# EAGLE design PGTNX02_2164_vca (EAGLE 9.6.0)
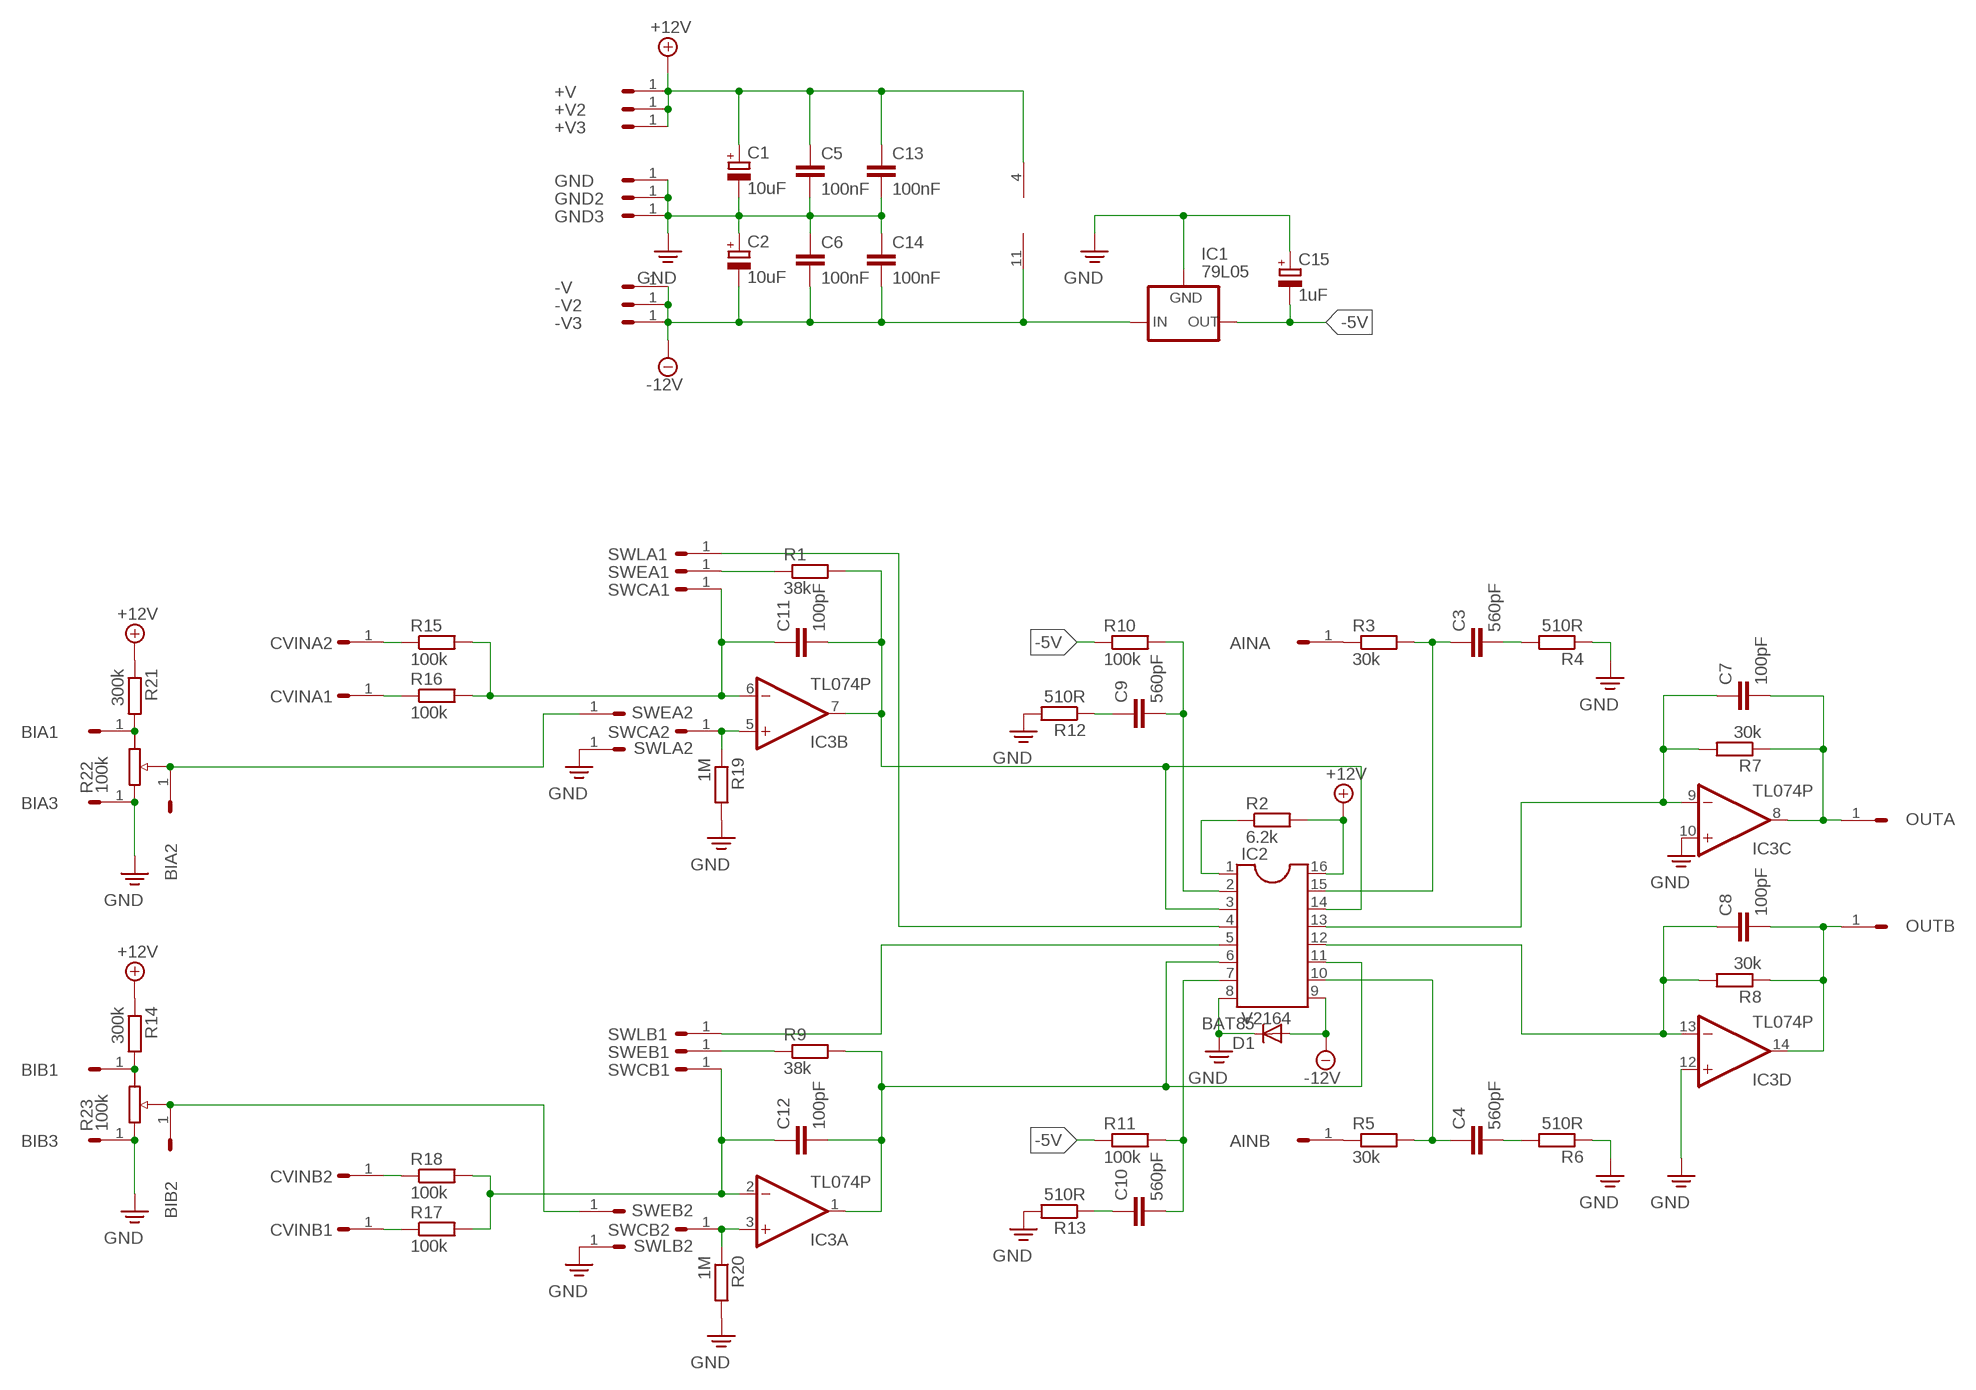
[diagram p0: schematic, sheet 1]

## Parts
+V  HEADER/MALE/01  [HEADER/MALE/01]
+V2  HEADER/MALE/01  [HEADER/MALE/01]
+V3  HEADER/MALE/01  [HEADER/MALE/01]
-V  HEADER/MALE/01  [HEADER/MALE/01]
-V2  HEADER/MALE/01  [HEADER/MALE/01]
-V3  HEADER/MALE/01  [HEADER/MALE/01]
AINA  HEADER/MALE/01  [HEADER/MALE/01]
AINB  HEADER/MALE/01  [HEADER/MALE/01]
BIA1  HEADER/MALE/01  [HEADER/MALE/01]
BIA2  HEADER/MALE/01  [HEADER/MALE/01]
BIA3  HEADER/MALE/01  [HEADER/MALE/01]
BIB1  HEADER/MALE/01  [HEADER/MALE/01]
BIB2  HEADER/MALE/01  [HEADER/MALE/01]
BIB3  HEADER/MALE/01  [HEADER/MALE/01]
C1  10uF  CAPACITOR/POLARIZEDE2.5-6  [E2,5-6]
C2  10uF  CAPACITOR/POLARIZEDE2.5-6  [E2,5-6]
C3  560pF  CAPACITORCERAMICDISC/5  [CERAMICDISC/5]
C4  560pF  CAPACITORCERAMICDISC/5  [CERAMICDISC/5]
C5  100nF  CAPACITORCERAMICDISC/5  [CERAMICDISC/5]
C6  100nF  CAPACITORCERAMICDISC/5  [CERAMICDISC/5]
C7  100pF  CAPACITORCERAMICDISC/5  [CERAMICDISC/5]
C8  100pF  CAPACITORCERAMICDISC/5  [CERAMICDISC/5]
C9  560pF  CAPACITORCERAMICDISC/5  [CERAMICDISC/5]
C10  560pF  CAPACITORCERAMICDISC/5  [CERAMICDISC/5]
C11  100pF  CAPACITORCERAMICDISC/5  [CERAMICDISC/5]
C12  100pF  CAPACITORCERAMICDISC/5  [CERAMICDISC/5]
C13  100nF  CAPACITORCERAMICDISC/5  [CERAMICDISC/5]
C14  100nF  CAPACITORCERAMICDISC/5  [CERAMICDISC/5]
C15  1uF  CAPACITOR/POLARIZEDE2.5-6  [E2,5-6]
CVINA1  HEADER/MALE/01  [HEADER/MALE/01]
CVINA2  HEADER/MALE/01  [HEADER/MALE/01]
CVINB1  HEADER/MALE/01  [HEADER/MALE/01]
CVINB2  HEADER/MALE/01  [HEADER/MALE/01]
D1  BAT85  1N4148DO35-7  [DO35-7]
GND  HEADER/MALE/01  [HEADER/MALE/01]
GND2  HEADER/MALE/01  [HEADER/MALE/01]
GND3  HEADER/MALE/01  [HEADER/MALE/01]
IC1  79L05  79LXX  [79LXX]
IC2  V2164  DIL16  [DIL16]
IC3  TL074P  [DIL14]
OUTA  HEADER/MALE/01  [HEADER/MALE/01]
OUTB  HEADER/MALE/01  [HEADER/MALE/01]
R1  38k  RESISTORRESISTOR/UPRIGHT/7.5  [RESISTOR/7.5]
R2  6.2k  RESISTORRESISTOR/UPRIGHT/7.5  [RESISTOR/7.5]
R3  30k  RESISTORRESISTOR/UPRIGHT/7.5  [RESISTOR/7.5]
R4  510R  RESISTORRESISTOR/UPRIGHT/7.5  [RESISTOR/7.5]
R5  30k  RESISTORRESISTOR/UPRIGHT/7.5  [RESISTOR/7.5]
R6  510R  RESISTORRESISTOR/UPRIGHT/7.5  [RESISTOR/7.5]
R7  30k  RESISTORRESISTOR/UPRIGHT/7.5  [RESISTOR/7.5]
R8  30k  RESISTORRESISTOR/UPRIGHT/7.5  [RESISTOR/7.5]
R9  38k  RESISTORRESISTOR/UPRIGHT/7.5  [RESISTOR/7.5]
R10  100k  RESISTORRESISTOR/UPRIGHT/7.5  [RESISTOR/7.5]
R11  100k  RESISTORRESISTOR/UPRIGHT/7.5  [RESISTOR/7.5]
R12  510R  RESISTORRESISTOR/UPRIGHT/7.5  [RESISTOR/7.5]
R13  510R  RESISTORRESISTOR/UPRIGHT/7.5  [RESISTOR/7.5]
R14  300k  RESISTORRESISTOR/UPRIGHT/7.5  [RESISTOR/7.5]
R15  100k  RESISTORRESISTOR/UPRIGHT/7.5  [RESISTOR/7.5]
R16  100k  RESISTORRESISTOR/UPRIGHT/7.5  [RESISTOR/7.5]
R17  100k  RESISTORRESISTOR/UPRIGHT/7.5  [RESISTOR/7.5]
R18  100k  RESISTORRESISTOR/UPRIGHT/7.5  [RESISTOR/7.5]
R19  1M  RESISTORRESISTOR/UPRIGHT/7.5  [RESISTOR/7.5]
R20  1M  RESISTORRESISTOR/UPRIGHT/7.5  [RESISTOR/7.5]
R21  300k  RESISTORRESISTOR/UPRIGHT/7.5  [RESISTOR/7.5]
R22  100k  POTENTIOMETER  (no package)
R23  100k  POTENTIOMETER  (no package)
SWCA1  HEADER/MALE/01  [HEADER/MALE/01]
SWCA2  HEADER/MALE/01  [HEADER/MALE/01]
SWCB1  HEADER/MALE/01  [HEADER/MALE/01]
SWCB2  HEADER/MALE/01  [HEADER/MALE/01]
SWEA1  HEADER/MALE/01  [HEADER/MALE/01]
SWEA2  HEADER/MALE/01  [HEADER/MALE/01]
SWEB1  HEADER/MALE/01  [HEADER/MALE/01]
SWEB2  HEADER/MALE/01  [HEADER/MALE/01]
SWLA1  HEADER/MALE/01  [HEADER/MALE/01]
SWLA2  HEADER/MALE/01  [HEADER/MALE/01]
SWLB1  HEADER/MALE/01  [HEADER/MALE/01]
SWLB2  HEADER/MALE/01  [HEADER/MALE/01]

## Nets
+12V: +V2.1 +V3.1 +V.1 C1.+ C5.1 C13.1 IC2.16 IC3.4(P:V+) R2.2 R14.1 R21.1
-5V: C15.- IC1.OUT R10.1 R11.1
-12V: -V2.1 -V3.1 -V.1 C2.- C6.2 C14.2 D1.A IC1.IN IC2.9 IC3.11(P:V-)
N$1: C9.2 IC2.2 R10.2
N$2: IC2.1 R2.1
N$3: AINA.1 R3.1
N$4: C3.1 IC2.15 R3.2
N$5: C3.2 R4.2
N$6: C7.1 IC2.13 IC3.9(C:-IN) R7.2
N$7: AINB.1 R5.1
N$8: C4.1 IC2.10 R5.2
N$9: C4.2 R6.2
N$10: C8.1 IC2.12 IC3.13(D:-IN) R8.2
N$11: C10.2 IC2.7 R11.2
N$12: C9.1 R12.1
N$13: C8.2 IC3.14(D:OUT) OUTB.1 R8.1
N$14: C7.2 IC3.8(C:OUT) OUTA.1 R7.1
N$15: R1.1 SWEA1.1
N$16: C11.1 IC3.6(B:-IN) R15.2 R16.2 SWCA1.1
N$17: C10.1 R13.1
N$18: C12.2 IC2.6 IC2.11 IC3.1(A:OUT) R9.2
N$19: IC2.4 SWLA1.1
N$20: C11.2 IC2.3 IC2.14 IC3.7(B:OUT) R1.2
N$21: BIB2.1 R23.S SWEB2.1
N$22: CVINA2.1 R15.1
N$23: CVINA1.1 R16.1
N$24: CVINB1.1 R17.1
N$25: CVINB2.1 R18.1
N$26: C12.1 IC3.2(A:-IN) R17.2 R18.2 SWCB1.1
N$27: R9.1 SWEB1.1
N$28: IC2.5 SWLB1.1
N$29: IC3.5(B:+IN) R19.1 SWCA2.1
N$30: IC3.3(A:+IN) R20.1 SWCB2.1
N$31: BIA1.1 R21.2 R22.A
N$33: BIB1.1 R14.2 R23.A
N$34: BIA2.1 R22.S SWEA2.1
PE: BIA3.1 BIB3.1 C1.- C2.+ C5.2 C6.1 C13.2 C14.1 C15.+ D1.C GND2.1 GND3.1 GND.1 IC1.GND IC2.8 IC3.10(C:+IN) IC3.12(D:+IN) R4.1 R6.1 R12.2 R13.2 R19.2 R20.2 R22.E R23.E SWLA2.1 SWLB2.1 ; supply symbol labelled GND

## Library data of the parts
+V +V2 +V3 -V -V2 -V3 GND GND2 GND3 = connectors:HEADER/MALE/01; SPICEPREFIX: X
AINA AINB BIA1-BIA3 BIB1-BIB3 CVINA1 CVINA2 CVINB1 CVINB2 OUTA OUTB SWCA1 SWCA2 SWCB1 SWCB2 SWEA1 SWEA2 SWEB1 SWEB2 SWLA1 SWLA2 SWLB1 SWLB2 = connectors:HEADER/MALE/01
C1 C2 C15 = capacitors:CAPACITOR/POLARIZED: POLARIZED CAPACITOR, European symbol; SPICEPREFIX: C
C3-C14 = capacitors:CAPACITOR: CAPACITOR, European symbol
D1 = transistors:1N4148: DIODE high speed (Philips)
IC1 = v-reg:79LXX: VOLTAGE REGULATOR
IC2 = ic_package:DIL16: Dual In Line / Socket
IC3 = ic_analogue:TL074: OP AMP
R1-R21 = resistors:RESISTOR: RESISTOR, European symbol
R22 R23 = controls_off_brd:POTENTIOMETER: Trimm resistor; _EXTERNAL_: 1

## Board
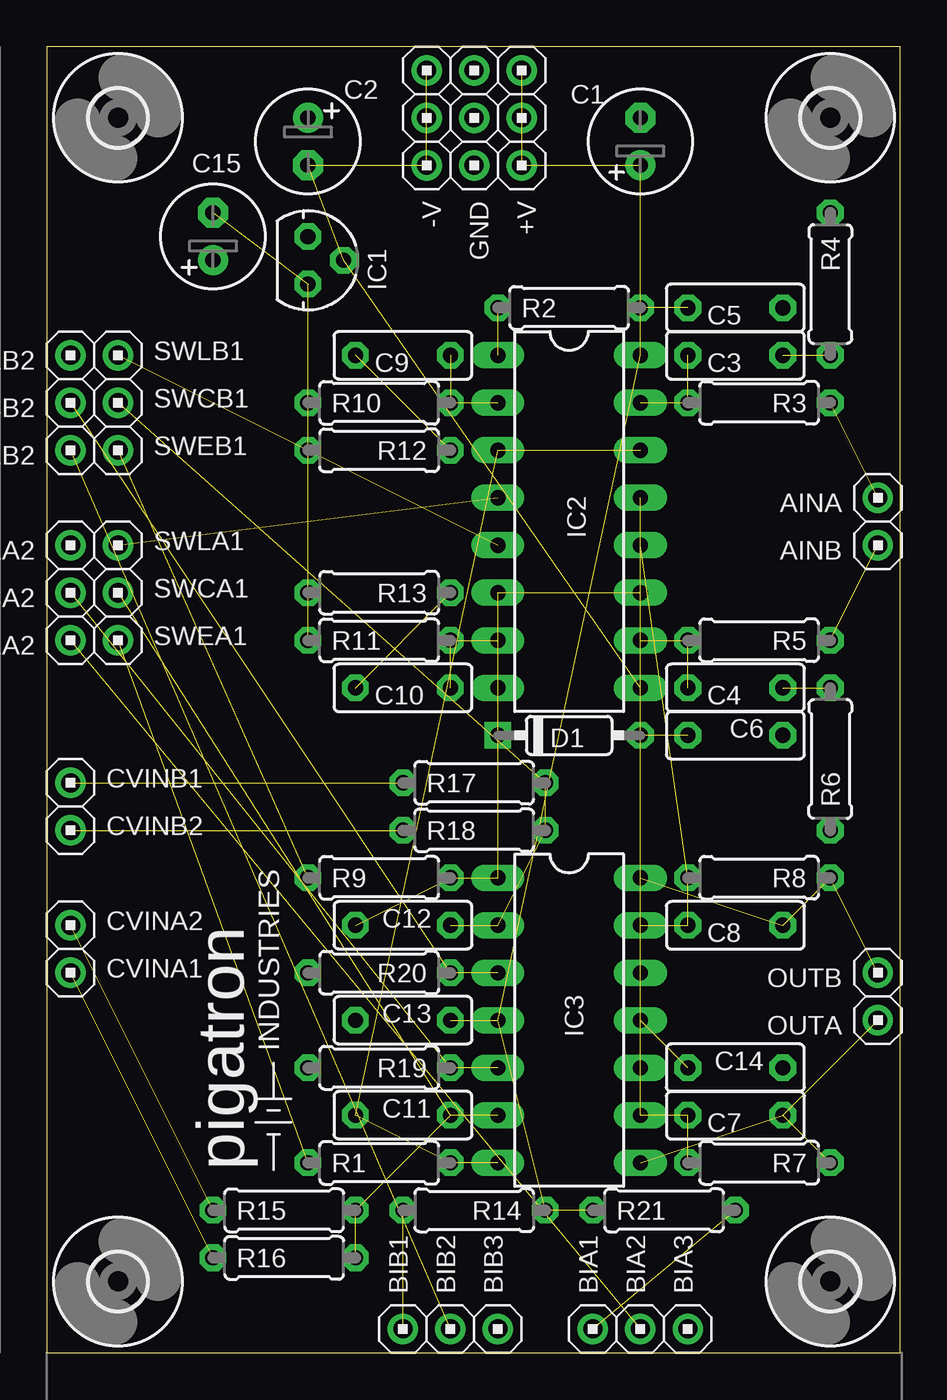
[diagram p1: board, top side]
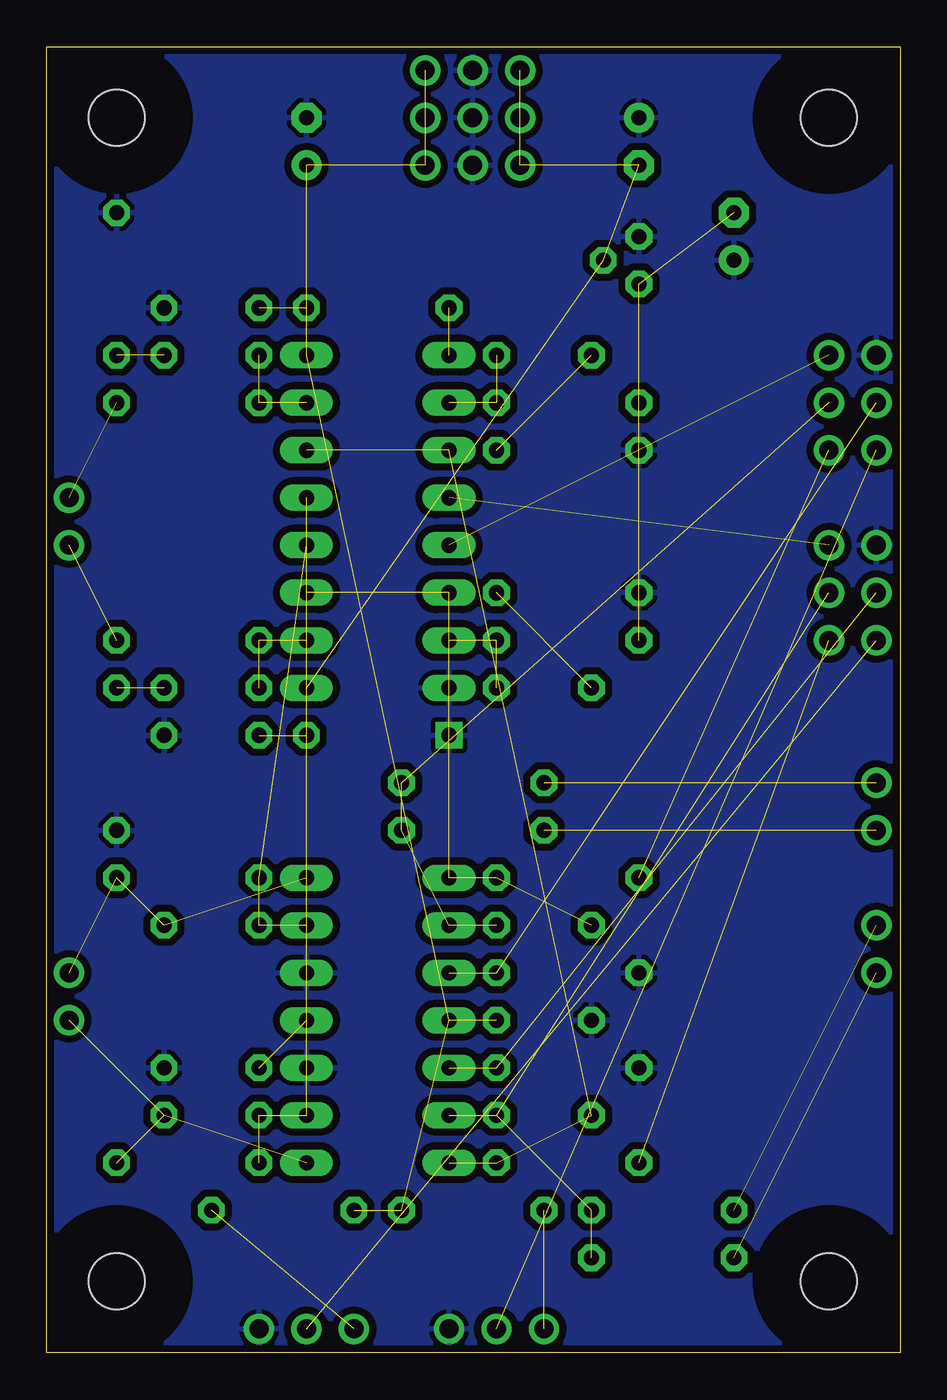
[diagram p2: board, bottom side, seen from below]

Size 45.64 x 69.84 mm. Coordinates in mm from the lower left corner, seen from the top.
Outline: 0,0 45.64,0 45.64,69.84 0,69.84 0,0
Copper layers (1*16): Top 0.0356mm / dielectric 1.5011mm / Bottom 0.0356mm
Design rules "pigatron": minimum track width 12mil, minimum drill 13mil, track to track 15mil, track to pad 10mil, pad to pad 10mil, via to via 10mil, smd to smd 6mil, copper to edge 15mil, drill to drill 10mil, minimum pad ring 12mil, minimum via ring 10mil, stop-mask expansion 4mil, vias tented up to drill 0mil, thermal gap 10mil

### Footprints (pad centres in the part's own frame; a part is rotated, then mirrored left to right if it is on the bottom)
HEADER/MALE/01 = drill 1.016: 1 0,0
E2,5-6 = drill 0.813 pad 1.6: + -1.27,0 | drill 0.813 pad 1.6 octagon: - 1.27,0
CERAMICDISC/5 = drill 0.813 octagon: 1 -2.54,0; 2 2.54,0
DO35-7 = drill 0.813 octagon: A 3.81,0 | drill 0.813 square: C -3.81,0
79LXX = drill 0.813 octagon: GND -1.27,0; IN 0,1.905; OUT 1.27,0
DIL16 = drill 0.813 long: 1 -8.89,-3.81; 2 -6.35,-3.81; 3 -3.81,-3.81; 4 -1.27,-3.81; 5 1.27,-3.81; 6 3.81,-3.81; 7 6.35,-3.81; 8 8.89,-3.81; 9 8.89,3.81; 10 6.35,3.81; 11 3.81,3.81; 12 1.27,3.81; 13 -1.27,3.81; 14 -3.81,3.81; 15 -6.35,3.81; 16 -8.89,3.81
DIL14 = drill 0.813 long: 1 -7.62,-3.81; 2 -5.08,-3.81; 3 -2.54,-3.81; 4 0,-3.81; 5 2.54,-3.81; 6 5.08,-3.81; 7 7.62,-3.81; 8 7.62,3.81; 9 5.08,3.81; 10 2.54,3.81; 11 0,3.81; 12 -2.54,3.81; 13 -5.08,3.81; 14 -7.62,3.81
RESISTOR/7.5 = drill 0.813 octagon: 1 -3.81,0; 2 3.81,0
STANDOFF/3.0 = hole 3: 0,0

### Placement (x,y rotation side)
+V  25.4,63.5 270 top
+V2  25.4,66.04 270 top
+V3  25.4,68.58 270 top
-V  20.32,63.5 270 top
-V2  20.32,66.04 270 top
-V3  20.32,68.58 270 top
AINA  44.45,45.72 180 top
AINB  44.45,43.18 180 top
BIA1  29.21,1.27 90 top
BIA2  31.75,1.27 90 top
BIA3  34.29,1.27 90 top
BIB1  19.05,1.27 90 top
BIB2  21.59,1.27 90 top
BIB3  24.13,1.27 90 top
C1  31.75,64.77 90 top
C2  13.97,64.77 270 top
C3  36.83,53.34 0 top
C4  36.83,35.56 0 top
C5  36.83,55.88 0 top
C6  36.83,33.02 180 top
C7  36.83,12.7 0 top
C8  36.83,22.86 0 top
C9  19.05,53.34 0 top
C10  19.05,35.56 0 top
C11  19.05,12.7 180 top
C12  19.05,22.86 180 top
C13  19.05,17.78 180 top
C14  36.83,15.24 180 top
C15  8.89,59.69 90 top
CVINA1  1.27,20.32 0 top
CVINA2  1.27,22.86 0 top
CVINB1  1.27,30.48 0 top
CVINB2  1.27,27.94 0 top
D1  27.94,33.02 0 top
GND  22.86,63.5 270 top
GND2  22.86,68.58 270 top
GND3  22.86,66.04 270 top
IC1  13.97,58.42 270 top
IC2  27.94,44.45 270 top
IC3  27.94,17.78 270 top
OUTA  44.45,17.78 180 top
OUTB  44.45,20.32 180 top
R1  17.78,10.16 0 top
R2  27.94,55.88 0 top
R3  38.1,50.8 180 top
R4  41.91,57.15 270 top
R5  38.1,38.1 180 top
R6  41.91,31.75 90 top
R7  38.1,10.16 180 top
R8  38.1,25.4 180 top
R9  17.78,25.4 0 top
R10  17.78,50.8 0 top
R11  17.78,38.1 0 top
R12  17.78,48.26 180 top
R13  17.78,40.64 180 top
R14  22.86,7.62 180 top
R15  12.7,7.62 0 top
R16  12.7,5.08 0 top
R17  22.86,30.48 0 top
R18  22.86,27.94 0 top
R19  17.78,15.24 180 top
R20  17.78,20.32 180 top
R21  33.02,7.62 0 top
SWCA1  3.81,40.64 0 top
SWCA2  1.27,40.64 180 top
SWCB1  3.81,50.8 0 top
SWCB2  1.27,50.8 180 top
SWEA1  3.81,38.1 0 top
SWEA2  1.27,38.1 180 top
SWEB1  3.81,48.26 0 top
SWEB2  1.27,48.26 180 top
SWLA1  3.81,43.18 0 top
SWLA2  1.27,43.18 180 top
SWLB1  3.81,53.34 0 top
SWLB2  1.27,53.34 180 top
U$1  [STANDOFF/3.0]  3.81,3.81 0 top
U$2  [STANDOFF/3.0]  41.91,3.81 0 top
U$3  [STANDOFF/3.0]  3.81,66.04 0 top
U$4  [STANDOFF/3.0]  41.91,66.04 0 top
U$5  [PIGATRON-LOGO]  10.54,18.67 90 top

### Tracks (layer width: path | path; a pad name or v marks a point on that pad's centre or on a via)
+12V  (10 unrouted)
-5V  (3 unrouted)
-12V  (9 unrouted)
N$1  (2 unrouted)
N$2  (1 unrouted)
N$3  (1 unrouted)
N$4  (2 unrouted)
N$5  (1 unrouted)
N$6  (3 unrouted)
N$7  (1 unrouted)
N$8  (2 unrouted)
N$9  (1 unrouted)
N$10  (3 unrouted)
N$11  (2 unrouted)
N$12  (1 unrouted)
N$13  (3 unrouted)
N$14  (3 unrouted)
N$15  (1 unrouted)
N$16  (4 unrouted)
N$17  (1 unrouted)
N$18  (4 unrouted)
N$19  (1 unrouted)
N$20  (4 unrouted)
N$21  (1 unrouted)
N$22  (1 unrouted)
N$23  (1 unrouted)
N$24  (1 unrouted)
N$25  (1 unrouted)
N$26  (4 unrouted)
N$27  (1 unrouted)
N$28  (1 unrouted)
N$29  (2 unrouted)
N$30  (2 unrouted)
N$31  (1 unrouted)
N$33  (1 unrouted)
N$34  (1 unrouted)
PE
  pour Bottom: 0,69.85 0,0 45.72,0 45.72,69.85

### Text on the board
tDocu: Rob Ellis 2020 | 2164_VCA | PGTNX02